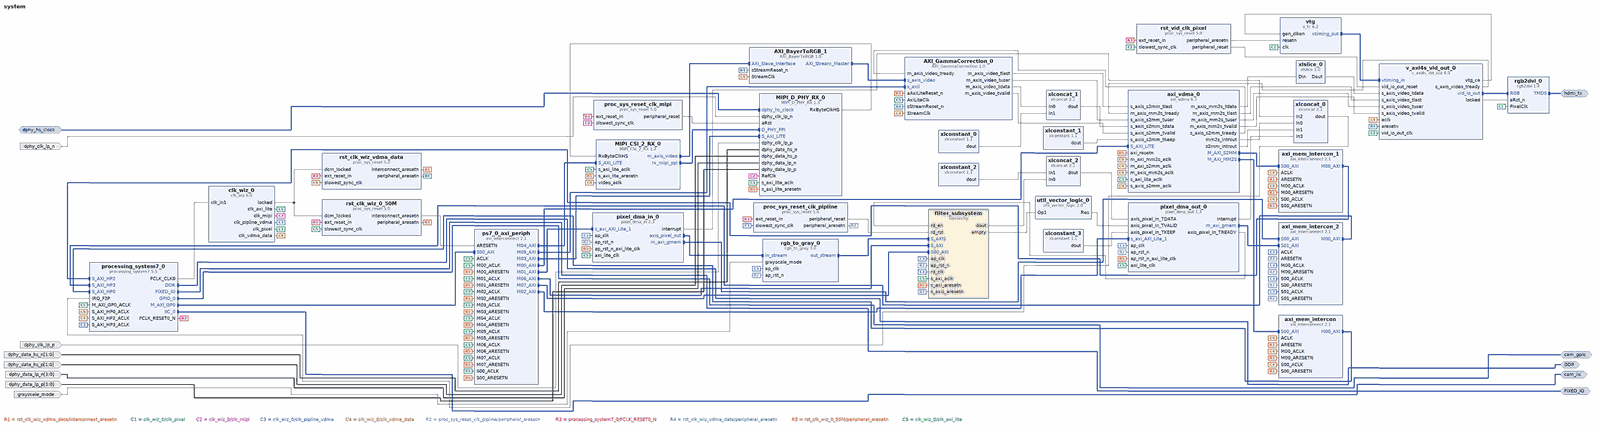
[diagram p0: block diagram of the top level, whole]
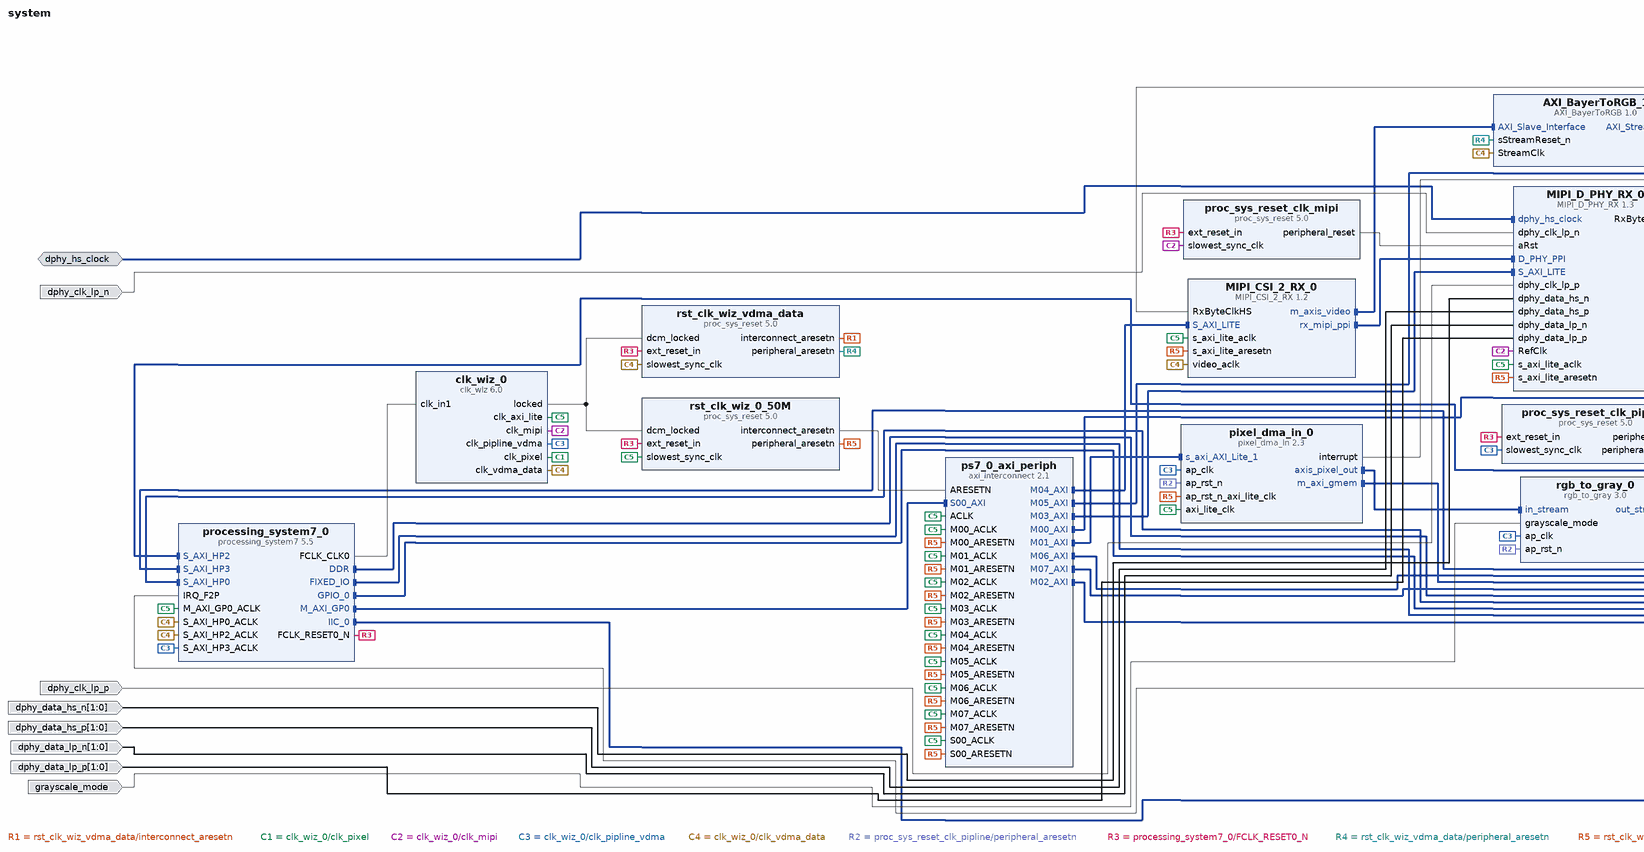
[diagram p1: block diagram of the top level, left part]
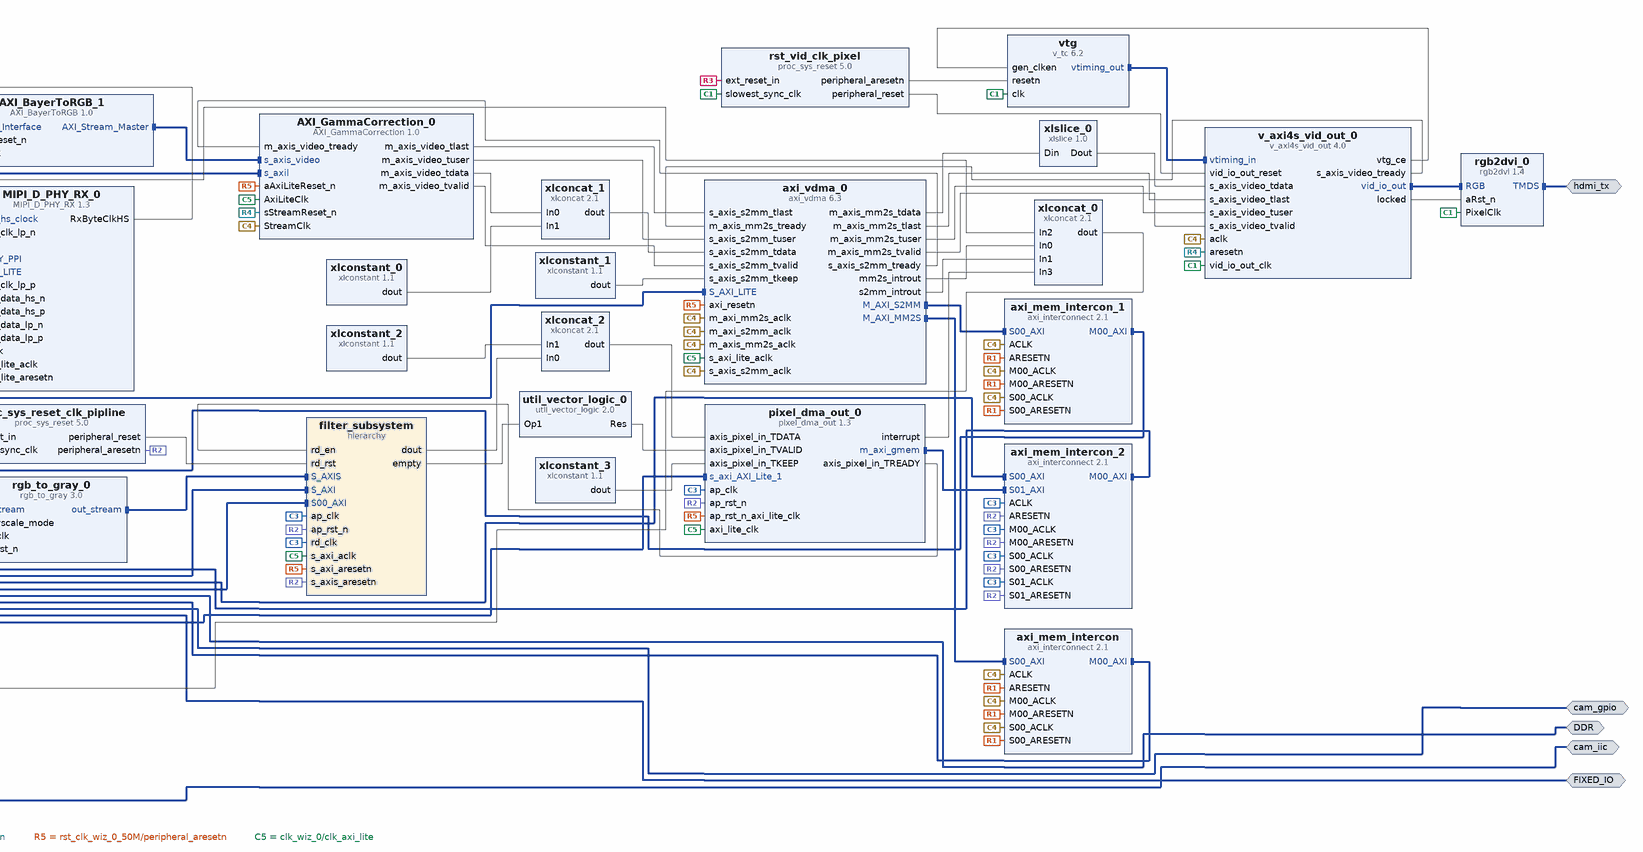
[diagram p2: block diagram of the top level, right part]
# Vivado block design system, xc7z020clg400-1, Vivado 2022.1
create_bd_design system

create_bd_intf_port -mode Master -vlnv xilinx.com:interface:ddrx_rtl:1.0 DDR
create_bd_intf_port -mode Master -vlnv xilinx.com:display_processing_system7:fixedio_rtl:1.0 FIXED_IO
create_bd_intf_port -mode Master -vlnv xilinx.com:interface:gpio_rtl:1.0 cam_gpio
create_bd_intf_port -mode Master -vlnv xilinx.com:interface:iic_rtl:1.0 cam_iic
create_bd_intf_port -mode Slave -vlnv xilinx.com:interface:diff_clock_rtl:1.0 dphy_hs_clock
set_property -dict {CONFIG.FREQ_HZ 336000000} [get_bd_intf_ports dphy_hs_clock]
create_bd_intf_port -mode Master -vlnv digilentinc.com:interface:tmds_rtl:1.0 hdmi_tx
create_bd_port -dir I dphy_clk_lp_n
create_bd_port -dir I dphy_clk_lp_p
create_bd_port -dir I -from 1 -to 0 dphy_data_hs_n
create_bd_port -dir I -from 1 -to 0 dphy_data_hs_p
create_bd_port -dir I -from 1 -to 0 dphy_data_lp_n
create_bd_port -dir I -from 1 -to 0 dphy_data_lp_p
create_bd_port -dir I -type data grayscale_mode

create_bd_cell -type ip -vlnv digilentinc.com:user:AXI_BayerToRGB:1.0 AXI_BayerToRGB_1
create_bd_cell -type ip -vlnv digilentinc.com:user:AXI_GammaCorrection:1.0 AXI_GammaCorrection_0
create_bd_cell -type ip -vlnv digilentinc.com:ip:MIPI_CSI_2_RX:1.2 MIPI_CSI_2_RX_0
set_property -dict {CONFIG.kDebug false CONFIG.kGenerateAXIL true} [get_bd_cells MIPI_CSI_2_RX_0]
create_bd_cell -type ip -vlnv digilentinc.com:ip:MIPI_D_PHY_RX:1.3 MIPI_D_PHY_RX_0
set_property -dict [list \
  CONFIG.kDebug false \
  CONFIG.kGenerateAXIL true \
  CONFIG.kLPFromLane0 false \
  CONFIG.kNoOfDataLanes 2 \
] [get_bd_cells MIPI_D_PHY_RX_0]
create_bd_cell -type ip -vlnv xilinx.com:ip:axi_interconnect:2.1 axi_mem_intercon
set_property -dict {CONFIG.NUM_MI 1 CONFIG.SYNCHRONIZATION_STAGES 2} [get_bd_cells axi_mem_intercon]
create_bd_cell -type ip -vlnv xilinx.com:ip:axi_interconnect:2.1 axi_mem_intercon_1
set_property -dict {CONFIG.NUM_MI 1 CONFIG.SYNCHRONIZATION_STAGES 2} [get_bd_cells axi_mem_intercon_1]
create_bd_cell -type ip -vlnv xilinx.com:ip:clk_wiz:6.0 clk_wiz_0
set_property -dict [list \
  CONFIG.CLKOUT1_DRIVES BUFG \
  CONFIG.CLKOUT1_JITTER 174.353 \
  CONFIG.CLKOUT1_PHASE_ERROR 132.063 \
  CONFIG.CLKOUT1_REQUESTED_OUT_FREQ 50 \
  CONFIG.CLKOUT2_DRIVES BUFG \
  CONFIG.CLKOUT2_JITTER 151.366 \
  CONFIG.CLKOUT2_PHASE_ERROR 132.063 \
  CONFIG.CLKOUT2_REQUESTED_OUT_FREQ 100 \
  CONFIG.CLKOUT2_USED true \
  CONFIG.CLKOUT3_DRIVES BUFG \
  CONFIG.CLKOUT3_JITTER 132.221 \
  CONFIG.CLKOUT3_PHASE_ERROR 132.063 \
  CONFIG.CLKOUT3_REQUESTED_OUT_FREQ 200 \
  CONFIG.CLKOUT3_USED true \
  CONFIG.CLKOUT4_DRIVES BUFG \
  CONFIG.CLKOUT4_JITTER 160.557 \
  CONFIG.CLKOUT4_PHASE_ERROR 132.063 \
  CONFIG.CLKOUT4_REQUESTED_OUT_FREQ 75.000 \
  CONFIG.CLKOUT4_USED true \
  CONFIG.CLKOUT5_DRIVES BUFG \
  CONFIG.CLKOUT5_JITTER 139.594 \
  CONFIG.CLKOUT5_PHASE_ERROR 132.063 \
  CONFIG.CLKOUT5_REQUESTED_OUT_FREQ 150.000 \
  CONFIG.CLKOUT5_USED true \
  CONFIG.CLKOUT6_DRIVES BUFG \
  CONFIG.CLKOUT7_DRIVES BUFG \
  CONFIG.CLK_OUT1_PORT clk_axi_lite \
  CONFIG.CLK_OUT2_PORT clk_vdma_data \
  CONFIG.CLK_OUT3_PORT clk_mipi \
  CONFIG.CLK_OUT4_PORT clk_pixel \
  CONFIG.CLK_OUT5_PORT clk_pipline_vdma \
  CONFIG.FEEDBACK_SOURCE FDBK_AUTO \
  CONFIG.MMCM_BANDWIDTH OPTIMIZED \
  CONFIG.MMCM_CLKFBOUT_MULT_F 6.000 \
  CONFIG.MMCM_CLKIN1_PERIOD 10.0 \
  CONFIG.MMCM_CLKIN2_PERIOD 10.0 \
  CONFIG.MMCM_CLKOUT0_DIVIDE_F 12.000 \
  CONFIG.MMCM_CLKOUT1_DIVIDE 6 \
  CONFIG.MMCM_CLKOUT2_DIVIDE 3 \
  CONFIG.MMCM_CLKOUT3_DIVIDE 8 \
  CONFIG.MMCM_CLKOUT4_DIVIDE 4 \
  CONFIG.MMCM_COMPENSATION ZHOLD \
  CONFIG.MMCM_DIVCLK_DIVIDE 1 \
  CONFIG.NUM_OUT_CLKS 5 \
  CONFIG.PRIMITIVE MMCM \
  CONFIG.PRIM_SOURCE Global_buffer \
  CONFIG.RESET_PORT reset \
  CONFIG.RESET_TYPE ACTIVE_HIGH \
  CONFIG.SECONDARY_SOURCE Single_ended_clock_capable_pin \
  CONFIG.USE_PHASE_ALIGNMENT true \
  CONFIG.USE_RESET false \
] [get_bd_cells clk_wiz_0]
create_bd_cell -type ip -vlnv xilinx.com:ip:processing_system7:5.5 processing_system7_0
set_property -dict [list \
  CONFIG.PCW_APU_PERIPHERAL_FREQMHZ 666.666666 \
  CONFIG.PCW_ENET0_ENET0_IO {MIO 16 .. 27} \
  CONFIG.PCW_ENET0_GRP_MDIO_ENABLE 1 \
  CONFIG.PCW_ENET0_GRP_MDIO_IO {MIO 52 .. 53} \
  CONFIG.PCW_ENET0_PERIPHERAL_ENABLE 1 \
  CONFIG.PCW_ENET_RESET_ENABLE 0 \
  CONFIG.PCW_FPGA0_PERIPHERAL_FREQMHZ 100 \
  CONFIG.PCW_FPGA1_PERIPHERAL_FREQMHZ 200 \
  CONFIG.PCW_FPGA2_PERIPHERAL_FREQMHZ 200 \
  CONFIG.PCW_GP0_EN_MODIFIABLE_TXN 0 \
  CONFIG.PCW_GP1_EN_MODIFIABLE_TXN 0 \
  CONFIG.PCW_GPIO_EMIO_GPIO_ENABLE 1 \
  CONFIG.PCW_GPIO_EMIO_GPIO_IO 1 \
  CONFIG.PCW_GPIO_EMIO_GPIO_WIDTH 1 \
  CONFIG.PCW_GPIO_MIO_GPIO_ENABLE 1 \
  CONFIG.PCW_GPIO_MIO_GPIO_IO MIO \
  CONFIG.PCW_I2C0_I2C0_IO EMIO \
  CONFIG.PCW_I2C0_PERIPHERAL_ENABLE 1 \
  CONFIG.PCW_I2C_PERIPHERAL_FREQMHZ 111.111115 \
  CONFIG.PCW_I2C_RESET_ENABLE 0 \
  CONFIG.PCW_IRQ_F2P_INTR 1 \
  CONFIG.PCW_PERIPHERAL_BOARD_PRESET part0 \
  CONFIG.PCW_PRESET_BANK1_VOLTAGE {LVCMOS 1.8V} \
  CONFIG.PCW_QSPI_GRP_FBCLK_ENABLE 1 \
  CONFIG.PCW_QSPI_GRP_FBCLK_IO {MIO 8} \
  CONFIG.PCW_QSPI_GRP_SINGLE_SS_ENABLE 1 \
  CONFIG.PCW_QSPI_GRP_SINGLE_SS_IO {MIO 1 .. 6} \
  CONFIG.PCW_QSPI_PERIPHERAL_ENABLE 1 \
  CONFIG.PCW_QSPI_QSPI_IO {MIO 1 .. 6} \
  CONFIG.PCW_SD0_GRP_CD_ENABLE 1 \
  CONFIG.PCW_SD0_GRP_CD_IO EMIO \
  CONFIG.PCW_SD0_GRP_WP_ENABLE 0 \
  CONFIG.PCW_SD0_PERIPHERAL_ENABLE 1 \
  CONFIG.PCW_SD0_SD0_IO {MIO 40 .. 45} \
  CONFIG.PCW_SDIO_PERIPHERAL_FREQMHZ 100 \
  CONFIG.PCW_SINGLE_QSPI_DATA_MODE x4 \
  CONFIG.PCW_S_AXI_HP3_DATA_WIDTH 32 \
  CONFIG.PCW_UART1_PERIPHERAL_ENABLE 1 \
  CONFIG.PCW_UART1_UART1_IO {MIO 48 .. 49} \
  CONFIG.PCW_UART_PERIPHERAL_FREQMHZ 100 \
  CONFIG.PCW_UIPARAM_DDR_FREQ_MHZ 533.333333 \
  CONFIG.PCW_UIPARAM_DDR_MEMORY_TYPE {DDR 3 (Low Voltage)} \
  CONFIG.PCW_UIPARAM_DDR_PARTNO {MT41K256M16 RE-125} \
  CONFIG.PCW_USB0_PERIPHERAL_ENABLE 1 \
  CONFIG.PCW_USB0_RESET_ENABLE 1 \
  CONFIG.PCW_USB0_RESET_IO {MIO 46} \
  CONFIG.PCW_USB0_USB0_IO {MIO 28 .. 39} \
  CONFIG.PCW_USB_RESET_ENABLE 1 \
  CONFIG.PCW_USB_RESET_SELECT {Share reset pin} \
  CONFIG.PCW_USE_FABRIC_INTERRUPT 1 \
  CONFIG.PCW_USE_S_AXI_HP0 1 \
  CONFIG.PCW_USE_S_AXI_HP2 1 \
  CONFIG.PCW_USE_S_AXI_HP3 1 \
] [get_bd_cells processing_system7_0]
# 509 more settings of processing_system7_0 are not shown: defaults, MIO pin electricals, DDR timing, and values the tool derives
create_bd_cell -type ip -vlnv xilinx.com:ip:axi_interconnect:2.1 ps7_0_axi_periph
set_property -dict {CONFIG.NUM_MI 8 CONFIG.SYNCHRONIZATION_STAGES 2} [get_bd_cells ps7_0_axi_periph]
create_bd_cell -type ip -vlnv digilentinc.com:ip:rgb2dvi:1.4 rgb2dvi_0
set_property -dict [list \
  CONFIG.kClkPrimitive MMCM \
  CONFIG.kClkRange 3 \
  CONFIG.kGenerateSerialClk true \
  CONFIG.kRstActiveHigh false \
] [get_bd_cells rgb2dvi_0]
create_bd_cell -type ip -vlnv xilinx.com:ip:proc_sys_reset:5.0 rst_clk_wiz_0_50M
create_bd_cell -type ip -vlnv xilinx.com:ip:proc_sys_reset:5.0 rst_vid_clk_pixel
create_bd_cell -type ip -vlnv xilinx.com:ip:v_axi4s_vid_out:4.0 v_axi4s_vid_out_0
set_property -dict {CONFIG.C_HAS_ASYNC_CLK 1 CONFIG.C_VTG_MASTER_SLAVE 1} [get_bd_cells v_axi4s_vid_out_0]
create_bd_cell -type ip -vlnv xilinx.com:ip:v_tc:6.2 vtg
set_property -dict {CONFIG.HAS_AXI4_LITE false CONFIG.VIDEO_MODE 1080p CONFIG.enable_detection false} [get_bd_cells vtg]
create_bd_cell -type ip -vlnv xilinx.com:ip:xlconcat:2.1 xlconcat_0
set_property -dict {CONFIG.NUM_PORTS 4} [get_bd_cells xlconcat_0]
create_bd_cell -type ip -vlnv xilinx.com:ip:axi_vdma:6.3 axi_vdma_0
set_property -dict [list \
  CONFIG.c_enable_vert_flip 0 \
  CONFIG.c_include_mm2s 1 \
  CONFIG.c_include_mm2s_dre 0 \
  CONFIG.c_include_s2mm 1 \
  CONFIG.c_m_axi_mm2s_data_width 32 \
  CONFIG.c_m_axi_s2mm_data_width 32 \
  CONFIG.c_m_axis_mm2s_tdata_width 32 \
  CONFIG.c_mm2s_linebuffer_depth 512 \
  CONFIG.c_mm2s_max_burst_length 16 \
  CONFIG.c_s2mm_genlock_mode 2 \
  CONFIG.c_s2mm_linebuffer_depth 1024 \
  CONFIG.c_use_s2mm_fsync 0 \
] [get_bd_cells axi_vdma_0]
create_bd_cell -type ip -vlnv xilinx.com:ip:xlconcat:2.1 xlconcat_1
set_property -dict {CONFIG.IN0_WIDTH 24 CONFIG.IN1_WIDTH 8 CONFIG.NUM_PORTS 2} [get_bd_cells xlconcat_1]
create_bd_cell -type ip -vlnv xilinx.com:ip:xlconstant:1.1 xlconstant_0
set_property -dict {CONFIG.CONST_VAL 0 CONFIG.CONST_WIDTH 8} [get_bd_cells xlconstant_0]
create_bd_cell -type ip -vlnv xilinx.com:ip:xlconstant:1.1 xlconstant_1
set_property -dict {CONFIG.CONST_VAL 15 CONFIG.CONST_WIDTH 4} [get_bd_cells xlconstant_1]
create_bd_cell -type ip -vlnv xilinx.com:ip:xlslice:1.0 xlslice_0
set_property -dict {CONFIG.DIN_FROM 23 CONFIG.DOUT_WIDTH 24} [get_bd_cells xlslice_0]
create_bd_cell -type ip -vlnv xilinx.com:ip:proc_sys_reset:5.0 rst_clk_wiz_vdma_data
create_bd_cell -type ip -vlnv xilinx.com:hls:pixel_dma_out:1.3 pixel_dma_out_0
create_bd_cell -type ip -vlnv xilinx.com:ip:xlconcat:2.1 xlconcat_2
create_bd_cell -type ip -vlnv xilinx.com:ip:xlconstant:1.1 xlconstant_2
set_property -dict {CONFIG.CONST_VAL 0x00 CONFIG.CONST_WIDTH 8} [get_bd_cells xlconstant_2]
create_bd_cell -type ip -vlnv xilinx.com:ip:xlconstant:1.1 xlconstant_3
set_property -dict {CONFIG.CONST_VAL 0b1111 CONFIG.CONST_WIDTH 4} [get_bd_cells xlconstant_3]
create_bd_cell -type ip -vlnv xilinx.com:ip:util_vector_logic:2.0 util_vector_logic_0
set_property -dict {CONFIG.C_OPERATION not CONFIG.C_SIZE 1} [get_bd_cells util_vector_logic_0]
create_bd_cell -type hier filter_subsystem
create_bd_cell -type ip -vlnv xilinx.com:ip:proc_sys_reset:5.0 proc_sys_reset_clk_pipline
create_bd_cell -type ip -vlnv xilinx.com:ip:proc_sys_reset:5.0 proc_sys_reset_clk_mipi
create_bd_cell -type ip -vlnv xilinx.com:hls:pixel_dma_in:2.3 pixel_dma_in_0
create_bd_cell -type ip -vlnv xilinx.com:ip:axi_interconnect:2.1 axi_mem_intercon_2
set_property -dict [list \
  CONFIG.NUM_MI 1 \
  CONFIG.NUM_SI 2 \
  CONFIG.S00_HAS_DATA_FIFO 2 \
  CONFIG.S01_HAS_DATA_FIFO 2 \
  CONFIG.STRATEGY 2 \
] [get_bd_cells axi_mem_intercon_2]
create_bd_cell -type ip -vlnv xilinx.com:hls:rgb_to_gray:3.0 rgb_to_gray_0

# ---- hierarchy /filter_subsystem ----
current_bd_instance /filter_subsystem
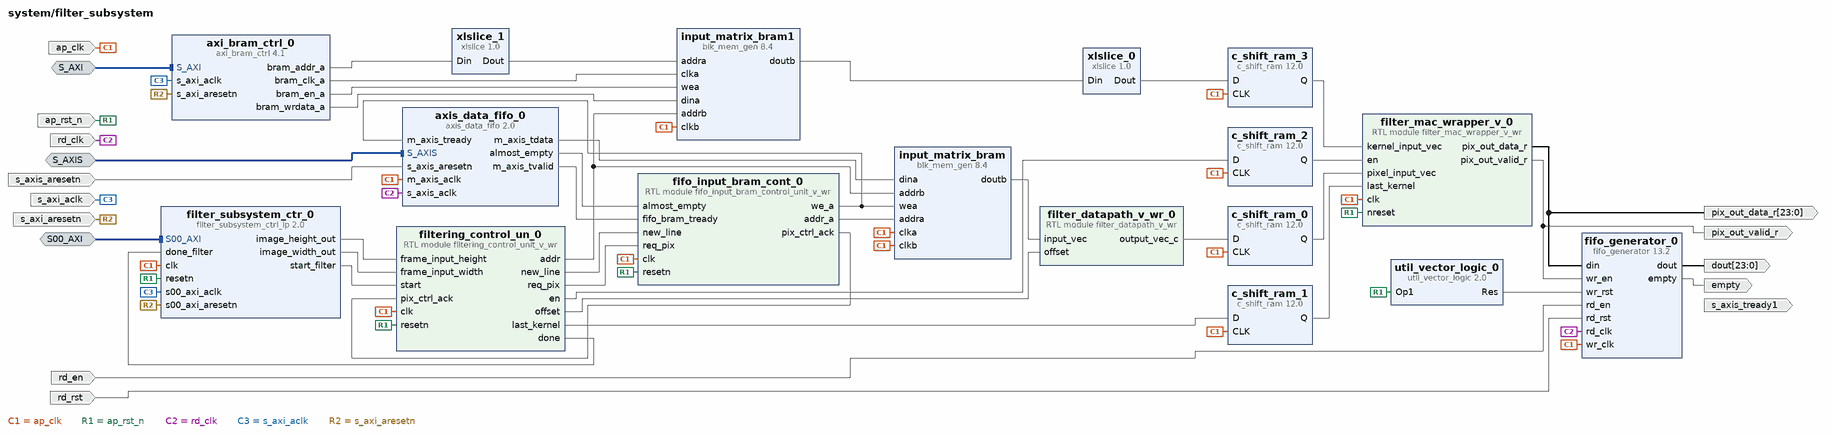
[diagram p3: block diagram inside /filter_subsystem]
create_bd_intf_pin -mode Slave -vlnv xilinx.com:interface:aximm_rtl:1.0 S_AXI
create_bd_intf_pin -mode Slave -vlnv xilinx.com:interface:aximm_rtl:1.0 S00_AXI
create_bd_intf_pin -mode Slave -vlnv xilinx.com:interface:axis_rtl:1.0 S_AXIS
create_bd_pin -dir O empty
create_bd_pin -dir O -from 23 -to 0 dout
create_bd_pin -dir I rd_en
create_bd_pin -dir I -type clk ap_clk
create_bd_pin -dir I -type rst ap_rst_n
create_bd_pin -dir I -type clk s_axi_aclk
create_bd_pin -dir I -type rst s_axi_aresetn
create_bd_pin -dir O -from 23 -to 0 pix_out_data_r
create_bd_pin -dir O pix_out_valid_r
create_bd_pin -dir O s_axis_tready1
create_bd_pin -dir I -type clk rd_clk
create_bd_pin -dir I rd_rst
create_bd_pin -dir I -type rst s_axis_aresetn

create_bd_cell -type module -reference filter_datapath_v_wr filter_datapath_v_wr_0
create_bd_cell -type module -reference fifo_input_bram_control_unit_v_wr fifo_input_bram_cont_0
create_bd_cell -type ip -vlnv xilinx.com:ip:axis_data_fifo:2.0 axis_data_fifo_0
set_property -dict {CONFIG.HAS_AEMPTY 1 CONFIG.IS_ACLK_ASYNC 1 CONFIG.TDATA_NUM_BYTES 4} [get_bd_cells axis_data_fifo_0]
create_bd_cell -type ip -vlnv xilinx.com:ip:blk_mem_gen:8.4 input_matrix_bram
set_property -dict [list \
  CONFIG.Enable_32bit_Address false \
  CONFIG.Enable_A Always_Enabled \
  CONFIG.Enable_B Always_Enabled \
  CONFIG.Memory_Type Simple_Dual_Port_RAM \
  CONFIG.Operating_Mode_A NO_CHANGE \
  CONFIG.Port_B_Clock 100 \
  CONFIG.Port_B_Enable_Rate 100 \
  CONFIG.Read_Width_B 128 \
  CONFIG.Register_PortB_Output_of_Memory_Primitives false \
  CONFIG.Use_Byte_Write_Enable false \
  CONFIG.Write_Depth_A 16 \
  CONFIG.Write_Width_B 128 \
  CONFIG.use_bram_block Stand_Alone \
] [get_bd_cells input_matrix_bram]
create_bd_cell -type ip -vlnv xilinx.com:ip:blk_mem_gen:8.4 input_matrix_bram1
set_property -dict [list \
  CONFIG.Coe_File ../../../../../kernel_simple.coe \
  CONFIG.Enable_32bit_Address false \
  CONFIG.Enable_A Always_Enabled \
  CONFIG.Enable_B Always_Enabled \
  CONFIG.Load_Init_File true \
  CONFIG.Memory_Type Simple_Dual_Port_RAM \
  CONFIG.Operating_Mode_A NO_CHANGE \
  CONFIG.Port_B_Clock 100 \
  CONFIG.Port_B_Enable_Rate 100 \
  CONFIG.Read_Width_B 128 \
  CONFIG.Register_PortB_Output_of_Memory_Primitives false \
  CONFIG.Use_Byte_Write_Enable false \
  CONFIG.Write_Depth_A 16 \
  CONFIG.Write_Width_B 128 \
  CONFIG.use_bram_block Stand_Alone \
] [get_bd_cells input_matrix_bram1]
create_bd_cell -type ip -vlnv xilinx.com:ip:xlslice:1.0 xlslice_0
set_property -dict {CONFIG.DIN_FROM 95 CONFIG.DIN_WIDTH 128 CONFIG.DOUT_WIDTH 96} [get_bd_cells xlslice_0]
create_bd_cell -type ip -vlnv xilinx.com:ip:axi_bram_ctrl:4.1 axi_bram_ctrl_0
set_property -dict {CONFIG.SINGLE_PORT_BRAM 1} [get_bd_cells axi_bram_ctrl_0]
create_bd_cell -type ip -vlnv xilinx.com:ip:fifo_generator:13.2 fifo_generator_0
set_property -dict [list \
  CONFIG.Enable_Reset_Synchronization false \
  CONFIG.Fifo_Implementation Independent_Clocks_Block_RAM \
  CONFIG.Full_Flags_Reset_Value 1 \
  CONFIG.Input_Data_Width 24 \
  CONFIG.Output_Data_Width 24 \
  CONFIG.Use_Dout_Reset true \
] [get_bd_cells fifo_generator_0]
create_bd_cell -type ip -vlnv xilinx.com:ip:util_vector_logic:2.0 util_vector_logic_0
set_property -dict {CONFIG.C_OPERATION not CONFIG.C_SIZE 1} [get_bd_cells util_vector_logic_0]
create_bd_cell -type module -reference filtering_control_unit_v_wr filtering_control_un_0
create_bd_cell -type ip -vlnv xilinx.com:user:filter_subsystem_ctrl_ip:2.0 filter_subsystem_ctr_0
create_bd_cell -type ip -vlnv xilinx.com:ip:xlslice:1.0 xlslice_1
set_property -dict {CONFIG.DIN_FROM 5 CONFIG.DIN_TO 2 CONFIG.DIN_WIDTH 13 CONFIG.DOUT_WIDTH 4} [get_bd_cells xlslice_1]
create_bd_cell -type ip -vlnv xilinx.com:ip:c_shift_ram:12.0 c_shift_ram_0
set_property -dict [list \
  CONFIG.AsyncInitVal 000000000000000000000000000000000000000000000000000000000000000000000000 \
  CONFIG.DefaultData 000000000000000000000000000000000000000000000000000000000000000000000000 \
  CONFIG.Depth 1 \
  CONFIG.SCLR false \
  CONFIG.ShiftRegType Fixed_Length \
  CONFIG.Width 72 \
] [get_bd_cells c_shift_ram_0]
create_bd_cell -type ip -vlnv xilinx.com:ip:c_shift_ram:12.0 c_shift_ram_1
set_property -dict [list \
  CONFIG.AsyncInitVal 0 \
  CONFIG.DefaultData 0 \
  CONFIG.Depth 1 \
  CONFIG.SCLR false \
  CONFIG.ShiftRegType Fixed_Length \
  CONFIG.Width 1 \
] [get_bd_cells c_shift_ram_1]
create_bd_cell -type ip -vlnv xilinx.com:ip:c_shift_ram:12.0 c_shift_ram_2
set_property -dict [list \
  CONFIG.AsyncInitVal 0 \
  CONFIG.DefaultData 0 \
  CONFIG.Depth 1 \
  CONFIG.SCLR false \
  CONFIG.ShiftRegType Fixed_Length \
  CONFIG.Width 1 \
] [get_bd_cells c_shift_ram_2]
create_bd_cell -type ip -vlnv xilinx.com:ip:c_shift_ram:12.0 c_shift_ram_3
set_property -dict [list \
  CONFIG.AsyncInitVal 000000000000000000000000000000000000000000000000000000000000000000000000000000000000000000000000 \
  CONFIG.DefaultData 000000000000000000000000000000000000000000000000000000000000000000000000000000000000000000000000 \
  CONFIG.Depth 1 \
  CONFIG.SCLR false \
  CONFIG.ShiftRegType Fixed_Length \
  CONFIG.Width 96 \
] [get_bd_cells c_shift_ram_3]
create_bd_cell -type module -reference filter_mac_wrapper_v_wr filter_mac_wrapper_v_0

# ---- connections ----

current_bd_instance /filter_subsystem
connect_bd_intf_net [get_bd_intf_pins S00_AXI] [get_bd_intf_pins filter_subsystem_ctr_0/S00_AXI]
connect_bd_intf_net [get_bd_intf_pins S_AXI] [get_bd_intf_pins axi_bram_ctrl_0/S_AXI]
connect_bd_intf_net [get_bd_intf_pins S_AXIS] [get_bd_intf_pins axis_data_fifo_0/S_AXIS]
connect_bd_net [get_bd_pins ap_clk] \
  [get_bd_pins fifo_input_bram_cont_0/clk] [get_bd_pins input_matrix_bram/clkb] [get_bd_pins input_matrix_bram/clka] \
  [get_bd_pins input_matrix_bram1/clkb] [get_bd_pins filtering_control_un_0/clk] [get_bd_pins filter_subsystem_ctr_0/clk] \
  [get_bd_pins fifo_generator_0/wr_clk] [get_bd_pins axis_data_fifo_0/m_axis_aclk] [get_bd_pins c_shift_ram_0/CLK] \
  [get_bd_pins c_shift_ram_1/CLK] [get_bd_pins c_shift_ram_2/CLK] [get_bd_pins c_shift_ram_3/CLK] \
  [get_bd_pins filter_mac_wrapper_v_0/clk]
connect_bd_net [get_bd_pins ap_rst_n] \
  [get_bd_pins fifo_input_bram_cont_0/resetn] [get_bd_pins util_vector_logic_0/Op1] \
  [get_bd_pins filtering_control_un_0/resetn] [get_bd_pins filter_subsystem_ctr_0/resetn] \
  [get_bd_pins filter_mac_wrapper_v_0/nreset]
connect_bd_net [get_bd_pins axi_bram_ctrl_0/bram_addr_a] [get_bd_pins xlslice_1/Din]
connect_bd_net [get_bd_pins axi_bram_ctrl_0/bram_clk_a] [get_bd_pins input_matrix_bram1/clka]
connect_bd_net [get_bd_pins axi_bram_ctrl_0/bram_en_a] [get_bd_pins input_matrix_bram1/wea]
connect_bd_net [get_bd_pins axi_bram_ctrl_0/bram_wrdata_a] [get_bd_pins input_matrix_bram1/dina]
connect_bd_net [get_bd_pins axis_data_fifo_0/almost_empty] [get_bd_pins fifo_input_bram_cont_0/almost_empty]
connect_bd_net [get_bd_pins axis_data_fifo_0/m_axis_tdata] [get_bd_pins input_matrix_bram/dina]
connect_bd_net [get_bd_pins axis_data_fifo_0/m_axis_tvalid] [get_bd_pins fifo_input_bram_cont_0/fifo_bram_tready]
connect_bd_net [get_bd_pins c_shift_ram_0/Q] [get_bd_pins filter_mac_wrapper_v_0/pixel_input_vec]
connect_bd_net [get_bd_pins c_shift_ram_1/Q] [get_bd_pins filter_mac_wrapper_v_0/last_kernel]
connect_bd_net [get_bd_pins c_shift_ram_2/Q] [get_bd_pins filter_mac_wrapper_v_0/en]
connect_bd_net [get_bd_pins c_shift_ram_3/Q] [get_bd_pins filter_mac_wrapper_v_0/kernel_input_vec]
connect_bd_net [get_bd_pins fifo_generator_0/dout] [get_bd_pins dout]
connect_bd_net [get_bd_pins fifo_generator_0/empty] [get_bd_pins empty]
connect_bd_net [get_bd_pins fifo_input_bram_cont_0/addr_a] [get_bd_pins input_matrix_bram/addra]
connect_bd_net [get_bd_pins fifo_input_bram_cont_0/pix_ctrl_ack] [get_bd_pins filtering_control_un_0/pix_ctrl_ack]
connect_bd_net [get_bd_pins fifo_input_bram_cont_0/we_a] [get_bd_pins axis_data_fifo_0/m_axis_tready] [get_bd_pins input_matrix_bram/wea]
connect_bd_net [get_bd_pins filter_datapath_v_wr_0/output_vec_c] [get_bd_pins c_shift_ram_0/D]
connect_bd_net [get_bd_pins filter_mac_wrapper_v_0/pix_out_data_r] [get_bd_pins fifo_generator_0/din] [get_bd_pins pix_out_data_r]
connect_bd_net [get_bd_pins filter_mac_wrapper_v_0/pix_out_valid_r] [get_bd_pins fifo_generator_0/wr_en] [get_bd_pins pix_out_valid_r]
connect_bd_net [get_bd_pins filter_subsystem_ctr_0/image_height_out] [get_bd_pins filtering_control_un_0/frame_input_height]
connect_bd_net [get_bd_pins filter_subsystem_ctr_0/image_width_out] [get_bd_pins filtering_control_un_0/frame_input_width]
connect_bd_net [get_bd_pins filter_subsystem_ctr_0/start_filter] [get_bd_pins filtering_control_un_0/start]
connect_bd_net [get_bd_pins filtering_control_un_0/addr] [get_bd_pins input_matrix_bram/addrb] [get_bd_pins input_matrix_bram1/addrb]
connect_bd_net [get_bd_pins filtering_control_un_0/done] [get_bd_pins filter_subsystem_ctr_0/done_filter]
connect_bd_net [get_bd_pins filtering_control_un_0/en] [get_bd_pins c_shift_ram_2/D]
connect_bd_net [get_bd_pins filtering_control_un_0/last_kernel] [get_bd_pins c_shift_ram_1/D]
connect_bd_net [get_bd_pins filtering_control_un_0/new_line] [get_bd_pins fifo_input_bram_cont_0/new_line]
connect_bd_net [get_bd_pins filtering_control_un_0/offset] [get_bd_pins filter_datapath_v_wr_0/offset]
connect_bd_net [get_bd_pins filtering_control_un_0/req_pix] [get_bd_pins fifo_input_bram_cont_0/req_pix]
connect_bd_net [get_bd_pins input_matrix_bram1/doutb] [get_bd_pins xlslice_0/Din]
connect_bd_net [get_bd_pins input_matrix_bram/doutb] [get_bd_pins filter_datapath_v_wr_0/input_vec]
connect_bd_net [get_bd_pins rd_clk] [get_bd_pins fifo_generator_0/rd_clk] [get_bd_pins axis_data_fifo_0/s_axis_aclk]
connect_bd_net [get_bd_pins rd_en] [get_bd_pins fifo_generator_0/rd_en]
connect_bd_net [get_bd_pins rd_rst] [get_bd_pins fifo_generator_0/rd_rst]
connect_bd_net [get_bd_pins s_axi_aclk] [get_bd_pins axi_bram_ctrl_0/s_axi_aclk] [get_bd_pins filter_subsystem_ctr_0/s00_axi_aclk]
connect_bd_net [get_bd_pins s_axi_aresetn] [get_bd_pins axi_bram_ctrl_0/s_axi_aresetn] [get_bd_pins filter_subsystem_ctr_0/s00_axi_aresetn]
connect_bd_net [get_bd_pins s_axis_aresetn] [get_bd_pins axis_data_fifo_0/s_axis_aresetn]
connect_bd_net [get_bd_pins util_vector_logic_0/Res] [get_bd_pins fifo_generator_0/wr_rst]
connect_bd_net [get_bd_pins xlslice_0/Dout] [get_bd_pins c_shift_ram_3/D]
connect_bd_net [get_bd_pins xlslice_1/Dout] [get_bd_pins input_matrix_bram1/addra]

current_bd_instance /
connect_bd_intf_net [get_bd_intf_pins AXI_BayerToRGB_1/AXI_Stream_Master] [get_bd_intf_pins AXI_GammaCorrection_0/s_axis_video]
connect_bd_intf_net [get_bd_intf_pins AXI_BayerToRGB_1/AXI_Slave_Interface] [get_bd_intf_pins MIPI_CSI_2_RX_0/m_axis_video]
connect_bd_intf_net [get_bd_intf_pins MIPI_CSI_2_RX_0/rx_mipi_ppi] [get_bd_intf_pins MIPI_D_PHY_RX_0/D_PHY_PPI]
connect_bd_intf_net [get_bd_intf_pins axi_mem_intercon_1/M00_AXI] [get_bd_intf_pins processing_system7_0/S_AXI_HP2]
connect_bd_intf_net [get_bd_intf_pins axi_mem_intercon_2/M00_AXI] [get_bd_intf_pins processing_system7_0/S_AXI_HP3]
connect_bd_intf_net [get_bd_intf_pins axi_mem_intercon/M00_AXI] [get_bd_intf_pins processing_system7_0/S_AXI_HP0]
connect_bd_intf_net [get_bd_intf_pins axi_mem_intercon/S00_AXI] [get_bd_intf_pins axi_vdma_0/M_AXI_MM2S]
connect_bd_intf_net [get_bd_intf_pins axi_mem_intercon_1/S00_AXI] [get_bd_intf_pins axi_vdma_0/M_AXI_S2MM]
connect_bd_intf_net [get_bd_intf_ports dphy_hs_clock] [get_bd_intf_pins MIPI_D_PHY_RX_0/dphy_hs_clock]
connect_bd_intf_net [get_bd_intf_pins pixel_dma_in_0/axis_pixel_out] [get_bd_intf_pins rgb_to_gray_0/in_stream]
connect_bd_intf_net [get_bd_intf_pins pixel_dma_in_0/m_axi_gmem] [get_bd_intf_pins axi_mem_intercon_2/S00_AXI]
connect_bd_intf_net [get_bd_intf_pins pixel_dma_out_0/m_axi_gmem] [get_bd_intf_pins axi_mem_intercon_2/S01_AXI]
connect_bd_intf_net [get_bd_intf_ports DDR] [get_bd_intf_pins processing_system7_0/DDR]
connect_bd_intf_net [get_bd_intf_ports FIXED_IO] [get_bd_intf_pins processing_system7_0/FIXED_IO]
connect_bd_intf_net [get_bd_intf_ports cam_gpio] [get_bd_intf_pins processing_system7_0/GPIO_0]
connect_bd_intf_net [get_bd_intf_ports cam_iic] [get_bd_intf_pins processing_system7_0/IIC_0]
connect_bd_intf_net [get_bd_intf_pins processing_system7_0/M_AXI_GP0] [get_bd_intf_pins ps7_0_axi_periph/S00_AXI]
connect_bd_intf_net [get_bd_intf_pins axi_vdma_0/S_AXI_LITE] [get_bd_intf_pins ps7_0_axi_periph/M00_AXI]
connect_bd_intf_net [get_bd_intf_pins pixel_dma_in_0/s_axi_AXI_Lite_1] [get_bd_intf_pins ps7_0_axi_periph/M01_AXI]
connect_bd_intf_net [get_bd_intf_pins pixel_dma_out_0/s_axi_AXI_Lite_1] [get_bd_intf_pins ps7_0_axi_periph/M02_AXI]
connect_bd_intf_net [get_bd_intf_pins MIPI_D_PHY_RX_0/S_AXI_LITE] [get_bd_intf_pins ps7_0_axi_periph/M03_AXI]
connect_bd_intf_net [get_bd_intf_pins MIPI_CSI_2_RX_0/S_AXI_LITE] [get_bd_intf_pins ps7_0_axi_periph/M04_AXI]
connect_bd_intf_net [get_bd_intf_pins AXI_GammaCorrection_0/s_axil] [get_bd_intf_pins ps7_0_axi_periph/M05_AXI]
connect_bd_intf_net [get_bd_intf_pins ps7_0_axi_periph/M06_AXI] [get_bd_intf_pins filter_subsystem/S_AXI]
connect_bd_intf_net [get_bd_intf_pins ps7_0_axi_periph/M07_AXI] [get_bd_intf_pins filter_subsystem/S00_AXI]
connect_bd_intf_net [get_bd_intf_ports hdmi_tx] [get_bd_intf_pins rgb2dvi_0/TMDS]
connect_bd_intf_net [get_bd_intf_pins rgb_to_gray_0/out_stream] [get_bd_intf_pins filter_subsystem/S_AXIS]
connect_bd_intf_net [get_bd_intf_pins rgb2dvi_0/RGB] [get_bd_intf_pins v_axi4s_vid_out_0/vid_io_out]
connect_bd_intf_net -intf_net v_tc_0_vtiming_out [get_bd_intf_pins v_axi4s_vid_out_0/vtiming_in] [get_bd_intf_pins vtg/vtiming_out]
connect_bd_net -net ARESETN_1 [get_bd_pins rst_clk_wiz_vdma_data/interconnect_aresetn] \
  [get_bd_pins axi_mem_intercon/ARESETN] [get_bd_pins axi_mem_intercon/S00_ARESETN] \
  [get_bd_pins axi_mem_intercon/M00_ARESETN] [get_bd_pins axi_mem_intercon_1/ARESETN] \
  [get_bd_pins axi_mem_intercon_1/S00_ARESETN] [get_bd_pins axi_mem_intercon_1/M00_ARESETN]
connect_bd_net [get_bd_pins AXI_GammaCorrection_0/m_axis_video_tdata] [get_bd_pins xlconcat_1/In0]
connect_bd_net [get_bd_pins AXI_GammaCorrection_0/m_axis_video_tlast] [get_bd_pins axi_vdma_0/s_axis_s2mm_tlast]
connect_bd_net [get_bd_pins AXI_GammaCorrection_0/m_axis_video_tuser] [get_bd_pins axi_vdma_0/s_axis_s2mm_tuser]
connect_bd_net [get_bd_pins AXI_GammaCorrection_0/m_axis_video_tvalid] [get_bd_pins axi_vdma_0/s_axis_s2mm_tvalid]
connect_bd_net [get_bd_pins MIPI_D_PHY_RX_0/RxByteClkHS] [get_bd_pins MIPI_CSI_2_RX_0/RxByteClkHS]
connect_bd_net -net PixelClk_Generator_clk_out1 [get_bd_pins clk_wiz_0/clk_pixel] \
  [get_bd_pins rgb2dvi_0/PixelClk] [get_bd_pins rst_vid_clk_pixel/slowest_sync_clk] \
  [get_bd_pins v_axi4s_vid_out_0/vid_io_out_clk] [get_bd_pins vtg/clk]
connect_bd_net [get_bd_pins axi_vdma_0/m_axis_mm2s_tdata] [get_bd_pins xlslice_0/Din]
connect_bd_net [get_bd_pins axi_vdma_0/m_axis_mm2s_tlast] [get_bd_pins v_axi4s_vid_out_0/s_axis_video_tlast]
connect_bd_net [get_bd_pins axi_vdma_0/m_axis_mm2s_tuser] [get_bd_pins v_axi4s_vid_out_0/s_axis_video_tuser]
connect_bd_net [get_bd_pins axi_vdma_0/m_axis_mm2s_tvalid] [get_bd_pins v_axi4s_vid_out_0/s_axis_video_tvalid]
connect_bd_net [get_bd_pins axi_vdma_0/mm2s_introut] [get_bd_pins xlconcat_0/In0]
connect_bd_net [get_bd_pins axi_vdma_0/s2mm_introut] [get_bd_pins xlconcat_0/In1]
connect_bd_net [get_bd_pins axi_vdma_0/s_axis_s2mm_tready] [get_bd_pins AXI_GammaCorrection_0/m_axis_video_tready]
connect_bd_net [get_bd_pins clk_wiz_0/clk_mipi] [get_bd_pins MIPI_D_PHY_RX_0/RefClk] [get_bd_pins proc_sys_reset_clk_mipi/slowest_sync_clk]
connect_bd_net [get_bd_pins clk_wiz_0/clk_pipline_vdma] \
  [get_bd_pins filter_subsystem/rd_clk] [get_bd_pins pixel_dma_out_0/ap_clk] \
  [get_bd_pins proc_sys_reset_clk_pipline/slowest_sync_clk] [get_bd_pins filter_subsystem/ap_clk] \
  [get_bd_pins processing_system7_0/S_AXI_HP3_ACLK] [get_bd_pins pixel_dma_in_0/ap_clk] [get_bd_pins axi_mem_intercon_2/ACLK] \
  [get_bd_pins axi_mem_intercon_2/S00_ACLK] [get_bd_pins axi_mem_intercon_2/M00_ACLK] \
  [get_bd_pins axi_mem_intercon_2/S01_ACLK] [get_bd_pins rgb_to_gray_0/ap_clk]
connect_bd_net [get_bd_pins clk_wiz_0/locked] [get_bd_pins rst_clk_wiz_0_50M/dcm_locked] [get_bd_pins rst_clk_wiz_vdma_data/dcm_locked]
connect_bd_net [get_bd_ports dphy_clk_lp_n] [get_bd_pins MIPI_D_PHY_RX_0/dphy_clk_lp_n]
connect_bd_net [get_bd_ports dphy_clk_lp_p] [get_bd_pins MIPI_D_PHY_RX_0/dphy_clk_lp_p]
connect_bd_net [get_bd_ports dphy_data_hs_n] [get_bd_pins MIPI_D_PHY_RX_0/dphy_data_hs_n]
connect_bd_net [get_bd_ports dphy_data_hs_p] [get_bd_pins MIPI_D_PHY_RX_0/dphy_data_hs_p]
connect_bd_net [get_bd_ports dphy_data_lp_n] [get_bd_pins MIPI_D_PHY_RX_0/dphy_data_lp_n]
connect_bd_net [get_bd_ports dphy_data_lp_p] [get_bd_pins MIPI_D_PHY_RX_0/dphy_data_lp_p]
connect_bd_net [get_bd_pins filter_subsystem/dout] [get_bd_pins xlconcat_2/In0]
connect_bd_net [get_bd_pins filter_subsystem/empty] [get_bd_pins util_vector_logic_0/Op1]
connect_bd_net -net grayscale_mode_0_1 [get_bd_ports grayscale_mode] [get_bd_pins rgb_to_gray_0/grayscale_mode]
connect_bd_net -net mm_clk_150 [get_bd_pins clk_wiz_0/clk_vdma_data] \
  [get_bd_pins AXI_BayerToRGB_1/StreamClk] [get_bd_pins AXI_GammaCorrection_0/StreamClk] \
  [get_bd_pins MIPI_CSI_2_RX_0/video_aclk] [get_bd_pins axi_mem_intercon/ACLK] [get_bd_pins axi_mem_intercon/M00_ACLK] \
  [get_bd_pins axi_mem_intercon/S00_ACLK] [get_bd_pins axi_mem_intercon_1/ACLK] [get_bd_pins axi_mem_intercon_1/M00_ACLK] \
  [get_bd_pins axi_mem_intercon_1/S00_ACLK] [get_bd_pins processing_system7_0/S_AXI_HP0_ACLK] \
  [get_bd_pins processing_system7_0/S_AXI_HP2_ACLK] [get_bd_pins v_axi4s_vid_out_0/aclk] \
  [get_bd_pins axi_vdma_0/m_axi_mm2s_aclk] [get_bd_pins axi_vdma_0/m_axis_mm2s_aclk] \
  [get_bd_pins axi_vdma_0/s_axis_s2mm_aclk] [get_bd_pins axi_vdma_0/m_axi_s2mm_aclk] \
  [get_bd_pins rst_clk_wiz_vdma_data/slowest_sync_clk]
connect_bd_net [get_bd_pins pixel_dma_in_0/interrupt] [get_bd_pins xlconcat_0/In2]
connect_bd_net [get_bd_pins pixel_dma_out_0/axis_pixel_in_TREADY] [get_bd_pins filter_subsystem/rd_en]
connect_bd_net [get_bd_pins pixel_dma_out_0/interrupt] [get_bd_pins xlconcat_0/In3]
connect_bd_net -net proc_sys_reset_0_peripheral_aresetn [get_bd_pins proc_sys_reset_clk_pipline/peripheral_aresetn] \
  [get_bd_pins pixel_dma_out_0/ap_rst_n] [get_bd_pins filter_subsystem/s_axis_aresetn] \
  [get_bd_pins filter_subsystem/ap_rst_n] [get_bd_pins pixel_dma_in_0/ap_rst_n] [get_bd_pins axi_mem_intercon_2/S00_ARESETN] \
  [get_bd_pins axi_mem_intercon_2/M00_ARESETN] [get_bd_pins axi_mem_intercon_2/ARESETN] \
  [get_bd_pins axi_mem_intercon_2/S01_ARESETN] [get_bd_pins rgb_to_gray_0/ap_rst_n]
connect_bd_net -net proc_sys_reset_0_peripheral_reset [get_bd_pins proc_sys_reset_clk_pipline/peripheral_reset] [get_bd_pins filter_subsystem/rd_rst]
connect_bd_net [get_bd_pins proc_sys_reset_clk_mipi/peripheral_reset] [get_bd_pins MIPI_D_PHY_RX_0/aRst]
connect_bd_net [get_bd_pins processing_system7_0/FCLK_CLK0] [get_bd_pins clk_wiz_0/clk_in1]
connect_bd_net [get_bd_pins processing_system7_0/FCLK_RESET0_N] \
  [get_bd_pins rst_clk_wiz_0_50M/ext_reset_in] [get_bd_pins rst_vid_clk_pixel/ext_reset_in] \
  [get_bd_pins rst_clk_wiz_vdma_data/ext_reset_in] [get_bd_pins proc_sys_reset_clk_pipline/ext_reset_in] \
  [get_bd_pins proc_sys_reset_clk_mipi/ext_reset_in]
connect_bd_net -net rst_clk_wiz_0_150M_peripheral_aresetn [get_bd_pins rst_clk_wiz_vdma_data/peripheral_aresetn] \
  [get_bd_pins AXI_BayerToRGB_1/sStreamReset_n] [get_bd_pins AXI_GammaCorrection_0/sStreamReset_n] \
  [get_bd_pins v_axi4s_vid_out_0/aresetn]
connect_bd_net [get_bd_pins rst_clk_wiz_0_50M/interconnect_aresetn] [get_bd_pins ps7_0_axi_periph/ARESETN]
connect_bd_net [get_bd_pins rst_clk_wiz_0_50M/peripheral_aresetn] \
  [get_bd_pins AXI_GammaCorrection_0/aAxiLiteReset_n] [get_bd_pins MIPI_CSI_2_RX_0/s_axi_lite_aresetn] \
  [get_bd_pins MIPI_D_PHY_RX_0/s_axi_lite_aresetn] [get_bd_pins ps7_0_axi_periph/M00_ARESETN] \
  [get_bd_pins ps7_0_axi_periph/M01_ARESETN] [get_bd_pins ps7_0_axi_periph/M02_ARESETN] \
  [get_bd_pins ps7_0_axi_periph/M03_ARESETN] [get_bd_pins ps7_0_axi_periph/M04_ARESETN] \
  [get_bd_pins ps7_0_axi_periph/M05_ARESETN] [get_bd_pins ps7_0_axi_periph/S00_ARESETN] [get_bd_pins axi_vdma_0/axi_resetn] \
  [get_bd_pins pixel_dma_out_0/ap_rst_n_axi_lite_clk] [get_bd_pins ps7_0_axi_periph/M06_ARESETN] \
  [get_bd_pins ps7_0_axi_periph/M07_ARESETN] [get_bd_pins filter_subsystem/s_axi_aresetn] \
  [get_bd_pins pixel_dma_in_0/ap_rst_n_axi_lite_clk]
connect_bd_net -net rst_vid_clk_dyn_peripheral_aresetn [get_bd_pins rst_vid_clk_pixel/peripheral_aresetn] [get_bd_pins vtg/resetn]
connect_bd_net -net rst_vid_clk_dyn_peripheral_reset [get_bd_pins rst_vid_clk_pixel/peripheral_reset] [get_bd_pins v_axi4s_vid_out_0/vid_io_out_reset]
connect_bd_net -net s_axil_clk_50 [get_bd_pins clk_wiz_0/clk_axi_lite] \
  [get_bd_pins AXI_GammaCorrection_0/AxiLiteClk] [get_bd_pins MIPI_CSI_2_RX_0/s_axi_lite_aclk] \
  [get_bd_pins MIPI_D_PHY_RX_0/s_axi_lite_aclk] [get_bd_pins processing_system7_0/M_AXI_GP0_ACLK] \
  [get_bd_pins ps7_0_axi_periph/ACLK] [get_bd_pins ps7_0_axi_periph/M00_ACLK] [get_bd_pins ps7_0_axi_periph/M01_ACLK] \
  [get_bd_pins ps7_0_axi_periph/M02_ACLK] [get_bd_pins ps7_0_axi_periph/M03_ACLK] [get_bd_pins ps7_0_axi_periph/M04_ACLK] \
  [get_bd_pins ps7_0_axi_periph/M05_ACLK] [get_bd_pins ps7_0_axi_periph/S00_ACLK] \
  [get_bd_pins rst_clk_wiz_0_50M/slowest_sync_clk] [get_bd_pins axi_vdma_0/s_axi_lite_aclk] \
  [get_bd_pins pixel_dma_out_0/axi_lite_clk] [get_bd_pins ps7_0_axi_periph/M06_ACLK] [get_bd_pins ps7_0_axi_periph/M07_ACLK] \
  [get_bd_pins filter_subsystem/s_axi_aclk] [get_bd_pins pixel_dma_in_0/axi_lite_clk]
connect_bd_net [get_bd_pins util_vector_logic_0/Res] [get_bd_pins pixel_dma_out_0/axis_pixel_in_TVALID]
connect_bd_net [get_bd_pins v_axi4s_vid_out_0/locked] [get_bd_pins rgb2dvi_0/aRst_n]
connect_bd_net [get_bd_pins v_axi4s_vid_out_0/s_axis_video_tready] [get_bd_pins axi_vdma_0/m_axis_mm2s_tready]
connect_bd_net [get_bd_pins v_axi4s_vid_out_0/vtg_ce] [get_bd_pins vtg/gen_clken]
connect_bd_net [get_bd_pins xlconcat_0/dout] [get_bd_pins processing_system7_0/IRQ_F2P]
connect_bd_net [get_bd_pins xlconcat_1/dout] [get_bd_pins axi_vdma_0/s_axis_s2mm_tdata]
connect_bd_net [get_bd_pins xlconcat_2/dout] [get_bd_pins pixel_dma_out_0/axis_pixel_in_TDATA]
connect_bd_net [get_bd_pins xlconstant_0/dout] [get_bd_pins xlconcat_1/In1]
connect_bd_net [get_bd_pins xlconstant_1/dout] [get_bd_pins axi_vdma_0/s_axis_s2mm_tkeep]
connect_bd_net [get_bd_pins xlconstant_2/dout] [get_bd_pins xlconcat_2/In1]
connect_bd_net [get_bd_pins xlconstant_3/dout] [get_bd_pins pixel_dma_out_0/axis_pixel_in_TKEEP]
connect_bd_net [get_bd_pins xlslice_0/Dout] [get_bd_pins v_axi4s_vid_out_0/s_axis_video_tdata]

# ---- address map ----
assign_bd_address -offset 0x00000000 -range 1G -target_address_space [get_bd_addr_spaces axi_vdma_0/Data_MM2S] [get_bd_addr_segs processing_system7_0/S_AXI_HP0/HP0_DDR_LOWOCM]
assign_bd_address -offset 0x00000000 -range 1G -target_address_space [get_bd_addr_spaces axi_vdma_0/Data_S2MM] [get_bd_addr_segs processing_system7_0/S_AXI_HP2/HP2_DDR_LOWOCM]
assign_bd_address -offset 0x00000000 -range 1G -target_address_space [get_bd_addr_spaces pixel_dma_in_0/Data_m_axi_gmem] [get_bd_addr_segs processing_system7_0/S_AXI_HP3/HP3_DDR_LOWOCM]
assign_bd_address -offset 0x00000000 -range 1G -target_address_space [get_bd_addr_spaces pixel_dma_out_0/Data_m_axi_gmem] [get_bd_addr_segs processing_system7_0/S_AXI_HP3/HP3_DDR_LOWOCM]
assign_bd_address -offset 0x40000000 -range 64K -target_address_space [get_bd_addr_spaces processing_system7_0/Data] [get_bd_addr_segs pixel_dma_in_0/s_axi_AXI_Lite_1/Reg]
assign_bd_address -offset 0x40010000 -range 64K -target_address_space [get_bd_addr_spaces processing_system7_0/Data] [get_bd_addr_segs pixel_dma_out_0/s_axi_AXI_Lite_1/Reg]
assign_bd_address -offset 0x43000000 -range 64K -target_address_space [get_bd_addr_spaces processing_system7_0/Data] [get_bd_addr_segs axi_vdma_0/S_AXI_LITE/Reg]
assign_bd_address -offset 0x43C20000 -range 64K -target_address_space [get_bd_addr_spaces processing_system7_0/Data] [get_bd_addr_segs MIPI_D_PHY_RX_0/S_AXI_LITE/S_AXI_LITE_reg]
assign_bd_address -offset 0x43C30000 -range 64K -target_address_space [get_bd_addr_spaces processing_system7_0/Data] [get_bd_addr_segs MIPI_CSI_2_RX_0/S_AXI_LITE/S_AXI_LITE_reg]
assign_bd_address -offset 0x43C40000 -range 64K -target_address_space [get_bd_addr_spaces processing_system7_0/Data] [get_bd_addr_segs AXI_GammaCorrection_0/s_axil/reg0]
assign_bd_address -offset 0x43C50000 -range 64K -target_address_space [get_bd_addr_spaces processing_system7_0/Data] [get_bd_addr_segs filter_subsystem/filter_subsystem_ctr_0/S00_AXI/S00_AXI_reg]
assign_bd_address -offset 0x43C60000 -range 8K -target_address_space [get_bd_addr_spaces processing_system7_0/Data] [get_bd_addr_segs filter_subsystem/axi_bram_ctrl_0/S_AXI/Mem0]

validate_bd_design
save_bd_design
